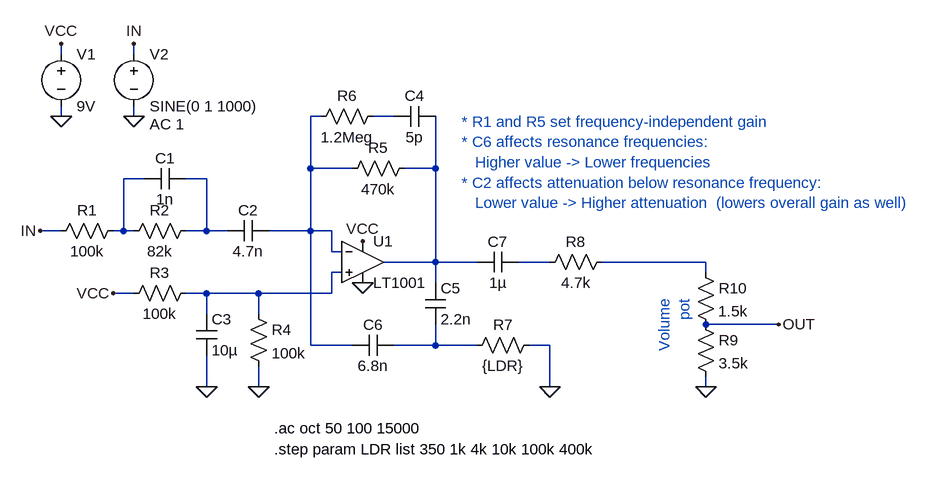
[diagram p0: schematic wah.asc]
wah.asc, the LTspice schematic file:
Version 4
SHEET 1 2724 680
WIRE 608 -144 608 -160
WIRE 720 -144 720 -160
WIRE 608 -48 608 -64
WIRE 720 -48 720 -64
WIRE 1008 -48 992 -48
WIRE 1120 -48 1088 -48
WIRE 992 32 992 -48
WIRE 1056 32 992 32
WIRE 1184 32 1184 -48
WIRE 1184 32 1136 32
WIRE 736 48 704 48
WIRE 832 48 800 48
WIRE 608 128 576 128
WIRE 704 128 704 48
WIRE 704 128 688 128
WIRE 720 128 704 128
WIRE 832 128 832 48
WIRE 832 128 800 128
WIRE 864 128 832 128
WIRE 992 128 992 32
WIRE 992 128 928 128
WIRE 1024 128 992 128
WIRE 1024 160 1024 128
WIRE 1040 160 1024 160
WIRE 1184 176 1184 32
WIRE 1184 176 1104 176
WIRE 1248 176 1184 176
WIRE 1360 176 1312 176
WIRE 1600 176 1440 176
WIRE 1040 192 1024 192
WIRE 1600 192 1600 176
WIRE 1184 208 1184 176
WIRE 720 224 688 224
WIRE 832 224 800 224
WIRE 912 224 832 224
WIRE 1024 224 1024 192
WIRE 1024 224 912 224
WIRE 832 256 832 224
WIRE 912 256 912 224
WIRE 1712 272 1600 272
WIRE 992 304 992 128
WIRE 1056 304 992 304
WIRE 1184 304 1184 272
WIRE 1184 304 1120 304
WIRE 1248 304 1184 304
WIRE 1360 304 1328 304
WIRE 832 368 832 320
WIRE 912 368 912 336
WIRE 1360 368 1360 304
WIRE 1600 368 1600 352
FLAG 912 368 0
FLAG 832 368 0
FLAG 608 -48 0
FLAG 688 224 VCC
FLAG 576 128 IN
FLAG 1360 368 0
FLAG 720 -48 0
FLAG 720 -160 IN
FLAG 1072 208 0
FLAG 1072 144 VCC
FLAG 608 -160 VCC
FLAG 1600 368 0
FLAG 1712 272 OUT
SYMBOL res 704 112 R90
WINDOW 0 0 56 VBottom 2
WINDOW 3 32 56 VTop 2
SYMATTR InstName R1
SYMATTR Value 100k
SYMBOL res 816 112 R90
WINDOW 0 0 56 VBottom 2
WINDOW 3 32 56 VTop 2
SYMATTR InstName R2
SYMATTR Value 82k
SYMBOL res 816 208 R90
WINDOW 0 0 56 VBottom 2
WINDOW 3 32 56 VTop 2
SYMATTR InstName R3
SYMATTR Value 100k
SYMBOL cap 736 64 R270
WINDOW 0 32 32 VTop 2
WINDOW 3 0 32 VBottom 2
SYMATTR InstName C1
SYMATTR Value 1n
SYMBOL cap 864 144 R270
WINDOW 0 32 32 VTop 2
WINDOW 3 0 32 VBottom 2
SYMATTR InstName C2
SYMATTR Value 4.7n
SYMBOL cap 816 256 R0
SYMATTR InstName C3
SYMATTR Value 10µ
SYMBOL res 896 240 R0
SYMATTR InstName R4
SYMATTR Value 100k
SYMBOL res 1040 48 R270
WINDOW 0 32 56 VTop 2
WINDOW 3 0 56 VBottom 2
SYMATTR InstName R5
SYMATTR Value 470k
SYMBOL res 992 -32 R270
WINDOW 0 32 56 VTop 2
WINDOW 3 0 56 VBottom 2
SYMATTR InstName R6
SYMATTR Value 1.2Meg
SYMBOL cap 1120 -32 R270
WINDOW 0 32 32 VTop 2
WINDOW 3 0 32 VBottom 2
SYMATTR InstName C4
SYMATTR Value 5p
SYMBOL cap 1168 208 R0
SYMATTR InstName C5
SYMATTR Value 2.2n
SYMBOL cap 1120 288 R90
WINDOW 0 0 32 VBottom 2
WINDOW 3 32 32 VTop 2
SYMATTR InstName C6
SYMATTR Value 6.8n
SYMBOL voltage 608 -160 R0
SYMATTR InstName V1
SYMATTR Value 9V
SYMBOL cap 1312 160 R90
WINDOW 0 0 32 VBottom 2
WINDOW 3 32 32 VTop 2
SYMATTR InstName C7
SYMATTR Value 1µ
SYMBOL res 1344 288 R90
WINDOW 0 0 56 VBottom 2
WINDOW 3 32 56 VTop 2
SYMATTR InstName R7
SYMATTR Value {LDR}
SYMBOL voltage 720 -160 R0
WINDOW 123 24 124 Left 2
WINDOW 39 0 0 Left 2
SYMATTR Value2 AC 1
SYMATTR InstName V2
SYMATTR Value SINE(0 1 1000)
SYMBOL Opamps\\LT1001 1072 112 R0
SYMATTR InstName U1
SYMBOL res 1456 160 R90
WINDOW 0 0 56 VBottom 2
WINDOW 3 32 56 VTop 2
SYMATTR InstName R8
SYMATTR Value 4.7k
SYMBOL res 1584 256 R0
SYMATTR InstName R9
SYMATTR Value 3.5k
SYMBOL res 1584 176 R0
WINDOW 3 35 76 Left 2
SYMATTR InstName R10
SYMATTR Value 1.5k
TEXT 936 464 Left 2 !.step param LDR list 350 1k 4k 10k 100k 400k
TEXT 936 432 Left 2 !.ac oct 50 100 15000
TEXT 1224 -40 Left 2 ;* R1 and R5 set frequency-independent gain\n* C6 affects resonance frequencies:\n   Higher value -> Lower frequencies\n* C2 affects attenuation below resonance frequency:\n   Lower value -> Higher attenuation  (lowers overall gain as well)
TEXT 1536 232 VRight 2 ;Volume\npot

The netlist it stands for:
* wah.asc
R1 N004 IN 100k
R2 N005 N004 82k
R3 N008 VCC 100k
C1 N004 N005 1n
C2 N005 N001 4.7n
C3 N008 0 10µ
R4 N008 0 100k
R5 N001 N003 470k
R6 N001 N002 1.2Meg
C4 N002 N003 5p
C5 N003 N009 2.2n
C6 N009 N001 6.8n
V1 VCC 0 9V
C7 N006 N003 1µ
R7 0 N009 {LDR}
V2 IN 0 SINE(0 1 1000) AC 1
XU1 N008 N001 VCC 0 N003 LT1001  ; pins In+ In- V+ V- OUT
R8 N007 N006 4.7k
R9 OUT 0 3.5k
R10 N007 OUT 1.5k
.step param LDR list 350 1k 4k 10k 100k 400k
.ac oct 50 100 15000
* * R1 and R5 set frequency-independent gain
* * C6 affects resonance frequencies:
*    Higher value -> Lower frequencies
* * C2 affects attenuation below resonance frequency:
*    Lower value -> Higher attenuation  (lowers overall gain as well)
* Volume
* pot
.lib LTC.lib
.backanno
.end